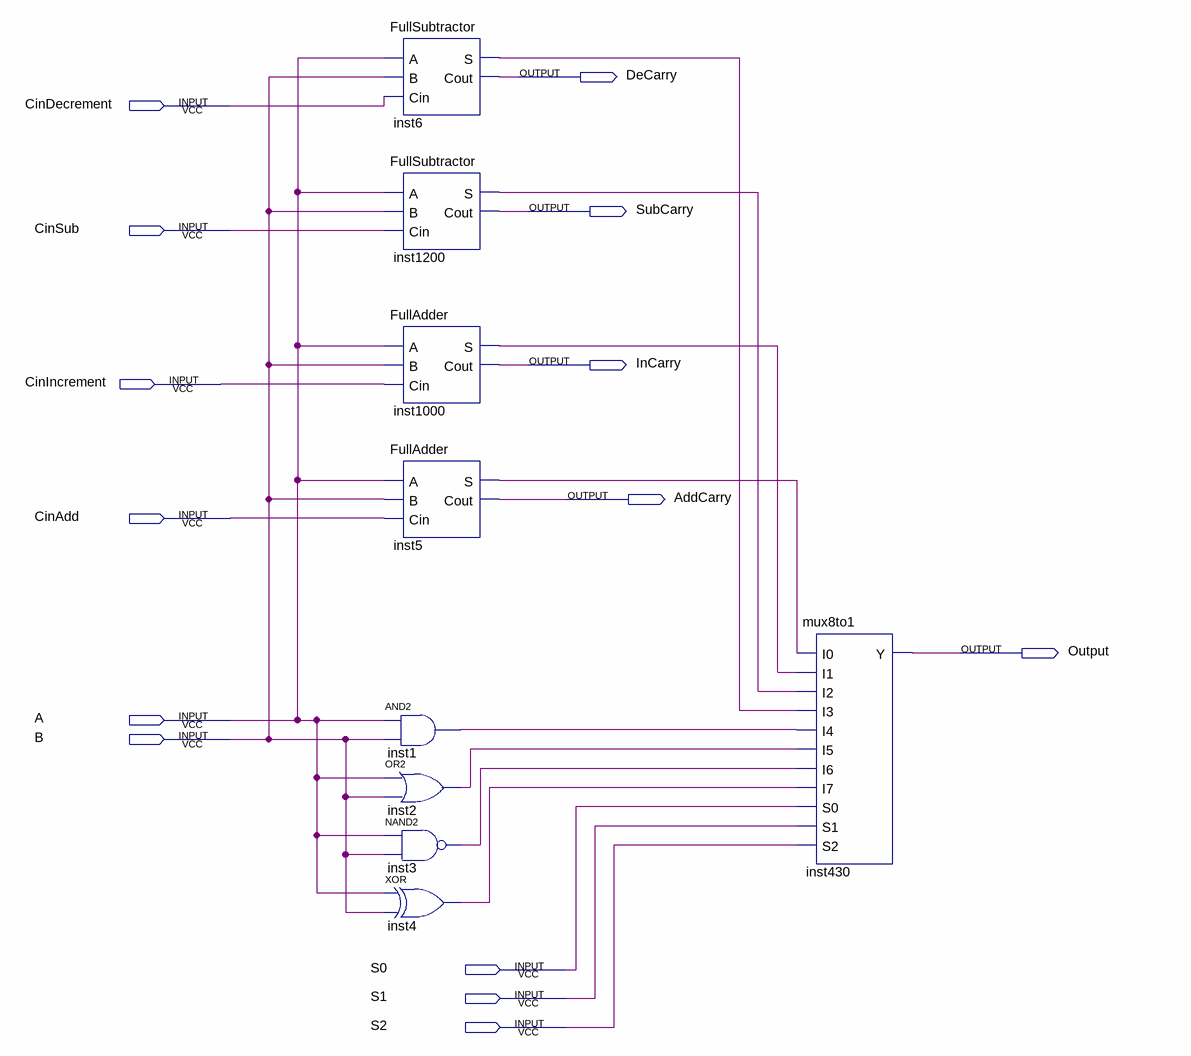
[diagram p0: schematic sheet]
// Quartus schematic ALU1bit.bdf as structural Verilog: 9 symbols, 14 pins
module ALU1bit (
  input  CinDecrement,
  input  CinSub,
  input  CinIncrement,
  input  CinAdd,
  input  A,
  input  B,
  input  S0,
  input  S1,
  input  S2,
  output DeCarry,
  output SubCarry,
  output InCarry,
  output AddCarry,
  output Output
);

  wire inst1_out, inst2_out, inst3_out, inst4_out, inst5_s, inst6_s, inst1000_s, inst1200_s;

  FullSubtractor inst6 (.A(A), .B(B), .Cin(CinDecrement), .S(inst6_s), .Cout(DeCarry));
  FullSubtractor inst1200 (.A(A), .B(B), .Cin(CinSub), .S(inst1200_s), .Cout(SubCarry));
  FullAdder inst1000 (.A(A), .B(B), .Cin(CinIncrement), .S(inst1000_s), .Cout(InCarry));
  FullAdder inst5 (.A(A), .B(B), .Cin(CinAdd), .S(inst5_s), .Cout(AddCarry));
  and inst1 (inst1_out, A, B);
  or inst2 (inst2_out, A, B);
  nand inst3 (inst3_out, A, B);
  xor inst4 (inst4_out, A, B);
  mux8to1 inst430 (
    .I0(inst5_s), .I1(inst1000_s), .I2(inst1200_s), .I3(inst6_s), .I4(inst1_out), .I5(inst2_out),
    .I6(inst3_out), .I7(inst4_out), .S0(S0), .S1(S1), .S2(S2), .Y(Output));
endmodule
